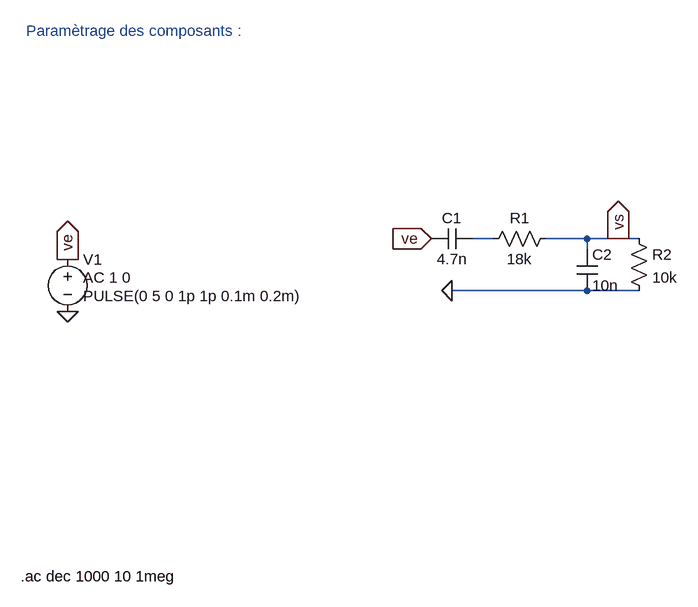
[diagram p0: schematic RC_RC_BP.asc]
RC_RC_BP.asc, the LTspice schematic file:
Version 4
SHEET 1 1780 680
WIRE -32 -64 -64 -64
WIRE 112 -64 48 -64
WIRE 160 -64 112 -64
WIRE 192 -64 160 -64
WIRE 112 -48 112 -64
WIRE 112 16 -96 16
WIRE 192 16 112 16
FLAG -688 48 0
FLAG -688 -32 ve
IOPIN -688 -32 Out
FLAG -96 16 0
FLAG 160 -64 vs
IOPIN 160 -64 Out
FLAG -128 -64 ve
IOPIN -128 -64 In
SYMBOL voltage -688 -48 R0
WINDOW 123 24 44 Left 2
WINDOW 39 0 0 Left 2
WINDOW 3 24 72 Left 2
SYMATTR Value2 AC 1 0
SYMATTR Value PULSE(0 5 0 1p 1p 0.1m 0.2m)
SYMATTR InstName V1
SYMBOL cap -128 -48 R270
WINDOW 0 32 32 VTop 2
WINDOW 3 0 32 VBottom 2
SYMATTR InstName C1
SYMATTR Value 4.7n
SYMBOL cap 96 -48 R0
SYMATTR InstName C2
SYMATTR Value 10n
SYMBOL res -48 -48 R270
WINDOW 0 32 56 VTop 2
WINDOW 3 0 56 VBottom 2
SYMATTR InstName R1
SYMATTR Value 18k
SYMBOL res 176 -80 R0
SYMATTR InstName R2
SYMATTR Value 10k
TEXT -752 -384 Left 2 ;Paramètrage des composants :
TEXT -760 456 Left 2 !.ac dec 1000 10 1meg

The netlist it stands for:
* RC_RC_BP.asc
V1 ve 0 PULSE(0 5 0 1p 1p 0.1m 0.2m) AC 1 0
C1 ve N001 4.7n
C2 vs 0 10n
R1 N001 vs 18k
R2 vs 0 10k
* Paramètrage des composants :
.ac dec 1000 10 1meg
.backanno
.end